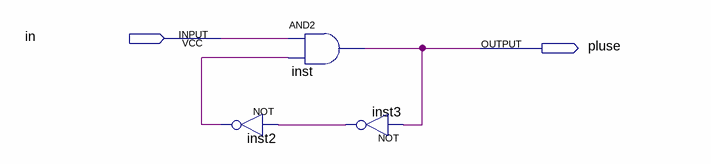
[diagram p0: schematic sheet]
// Quartus schematic symm_gen.bdf as structural Verilog: 3 symbols, 2 pins
module symm_gen (
  input  in,
  output pluse
);

  wire inst2_out, inst3_out;

  not inst2 (inst2_out, inst3_out);
  and inst (pluse, in, inst2_out);
  not inst3 (inst3_out, pluse);
endmodule
